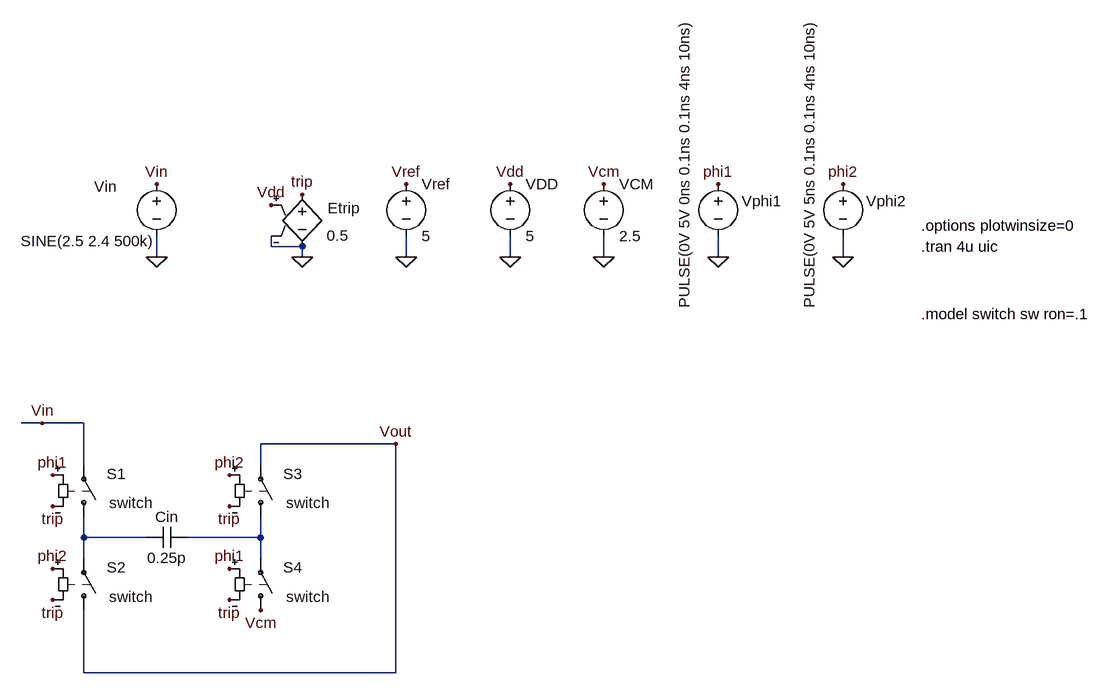
[diagram p0: schematic sim3_switched_capacitor.asc]
sim3_switched_capacitor.asc, the LTspice schematic file:
Version 4
SHEET 1 2804 696
WIRE 1392 -528 1392 -544
WIRE 1440 -528 1392 -528
WIRE 1216 -512 1216 -544
WIRE 1440 -512 1440 -528
WIRE 1600 -512 1600 -544
WIRE 1760 -512 1760 -544
WIRE 1904 -512 1904 -544
WIRE 2080 -512 2080 -544
WIRE 2272 -512 2272 -544
WIRE 1040 -256 1008 -256
WIRE 1104 -256 1040 -256
WIRE 1584 -224 1376 -224
WIRE 1104 -192 1104 -256
WIRE 1376 -192 1376 -224
WIRE 1104 -80 1104 -112
WIRE 1200 -80 1104 -80
WIRE 1376 -80 1376 -112
WIRE 1376 -80 1264 -80
WIRE 1104 -48 1104 -80
WIRE 1376 -48 1376 -80
WIRE 1104 128 1104 32
WIRE 1584 128 1584 -224
WIRE 1584 128 1104 128
FLAG 1216 -512 0
FLAG 1040 -256 Vin
FLAG 2080 -512 0
FLAG 2080 -624 phi1
FLAG 1760 -512 0
FLAG 1760 -624 Vdd
FLAG 1904 -512 0
FLAG 1904 -624 Vcm
FLAG 1600 -512 0
FLAG 1600 -624 Vref
FLAG 1216 -624 Vin
FLAG 1376 32 Vcm
FLAG 1440 -512 0
FLAG 1392 -592 Vdd
FLAG 1440 -608 trip
FLAG 1056 -128 trip
FLAG 1056 16 trip
FLAG 1328 -128 trip
FLAG 1328 16 trip
FLAG 1056 -176 phi1
FLAG 1328 -32 phi1
FLAG 1056 -32 phi2
FLAG 1328 -176 phi2
FLAG 2272 -512 0
FLAG 2272 -624 phi2
FLAG 1584 -224 Vout
SYMBOL voltage 1216 -640 R0
WINDOW 123 0 0 Left 0
WINDOW 39 0 0 Left 0
WINDOW 0 -96 20 Left 2
WINDOW 3 -209 104 Left 2
SYMATTR InstName Vin
SYMATTR Value SINE(2.5 2.4 500k)
SYMBOL voltage 2080 -640 R0
WINDOW 0 36 42 Left 2
WINDOW 3 -52 207 VLeft 2
WINDOW 123 0 0 Left 0
WINDOW 39 0 0 Left 0
SYMATTR InstName Vphi1
SYMATTR Value PULSE(0V 5V 0ns 0.1ns 0.1ns 4ns 10ns)
SYMBOL voltage 1760 -640 R0
WINDOW 123 0 0 Left 0
WINDOW 39 0 0 Left 0
SYMATTR InstName VDD
SYMATTR Value 5
SYMBOL voltage 1904 -640 R0
WINDOW 123 0 0 Left 0
WINDOW 39 0 0 Left 0
SYMATTR InstName VCM
SYMATTR Value 2.5
SYMBOL voltage 1600 -640 R0
WINDOW 123 0 0 Left 0
WINDOW 39 0 0 Left 0
SYMATTR InstName Vref
SYMATTR Value 5
SYMBOL sw 1104 -96 M180
WINDOW 3 24 -12 Left 0
WINDOW 38 39 37 Left 2
WINDOW 0 35 82 Left 2
SYMATTR Value ""
SYMATTR SpiceModel switch
SYMATTR InstName S1
SYMBOL cap 1264 -96 R90
WINDOW 0 0 32 VBottom 2
WINDOW 3 32 32 VTop 2
SYMATTR InstName Cin
SYMATTR Value 0.25p
SYMBOL sw 1104 48 M180
WINDOW 3 24 -12 Left 0
WINDOW 38 39 37 Left 2
WINDOW 0 35 82 Left 2
SYMATTR Value ""
SYMATTR SpiceModel switch
SYMATTR InstName S2
SYMBOL sw 1376 -96 M180
WINDOW 3 24 -12 Left 0
WINDOW 38 39 37 Left 2
WINDOW 0 35 82 Left 2
SYMATTR Value ""
SYMATTR SpiceModel switch
SYMATTR InstName S3
SYMBOL sw 1376 48 M180
WINDOW 3 24 -12 Left 0
WINDOW 38 39 37 Left 2
WINDOW 0 35 82 Left 2
SYMATTR Value ""
SYMATTR SpiceModel switch
SYMATTR InstName S4
SYMBOL e 1440 -624 R0
WINDOW 0 39 37 Left 2
WINDOW 3 38 79 Left 2
SYMATTR InstName Etrip
SYMATTR Value 0.5
SYMBOL voltage 2272 -640 R0
WINDOW 0 36 42 Left 2
WINDOW 3 -52 207 VLeft 2
WINDOW 123 0 0 Left 0
WINDOW 39 0 0 Left 0
SYMATTR InstName Vphi2
SYMATTR Value PULSE(0V 5V 5ns 0.1ns 0.1ns 4ns 10ns)
TEXT 2392 -528 Left 2 !.tran 4u uic
TEXT 2392 -560 Left 2 !.options plotwinsize=0
TEXT 2392 -424 Left 2 !.model switch sw ron=.1

The netlist it stands for:
* sim3_switched_capacitor.asc
Vin Vin 0 SINE(2.5 2.4 500k)
Vphi1 phi1 0 PULSE(0V 5V 0ns 0.1ns 0.1ns 4ns 10ns)
VDD Vdd 0 5
VCM Vcm 0 2.5
Vref Vref 0 5
S1 N001 Vin phi1 trip switch
Cin N002 N001 0.25p
S2 Vout N001 phi2 trip switch
S3 N002 Vout phi2 trip switch
S4 Vcm N002 phi1 trip switch
Etrip trip 0 Vdd 0 0.5
Vphi2 phi2 0 PULSE(0V 5V 5ns 0.1ns 0.1ns 4ns 10ns)
.tran 4u uic
.options plotwinsize=0
.model switch sw ron=.1
.backanno
.end